# EAGLE schematic Shield (EAGLE 9.6.2)
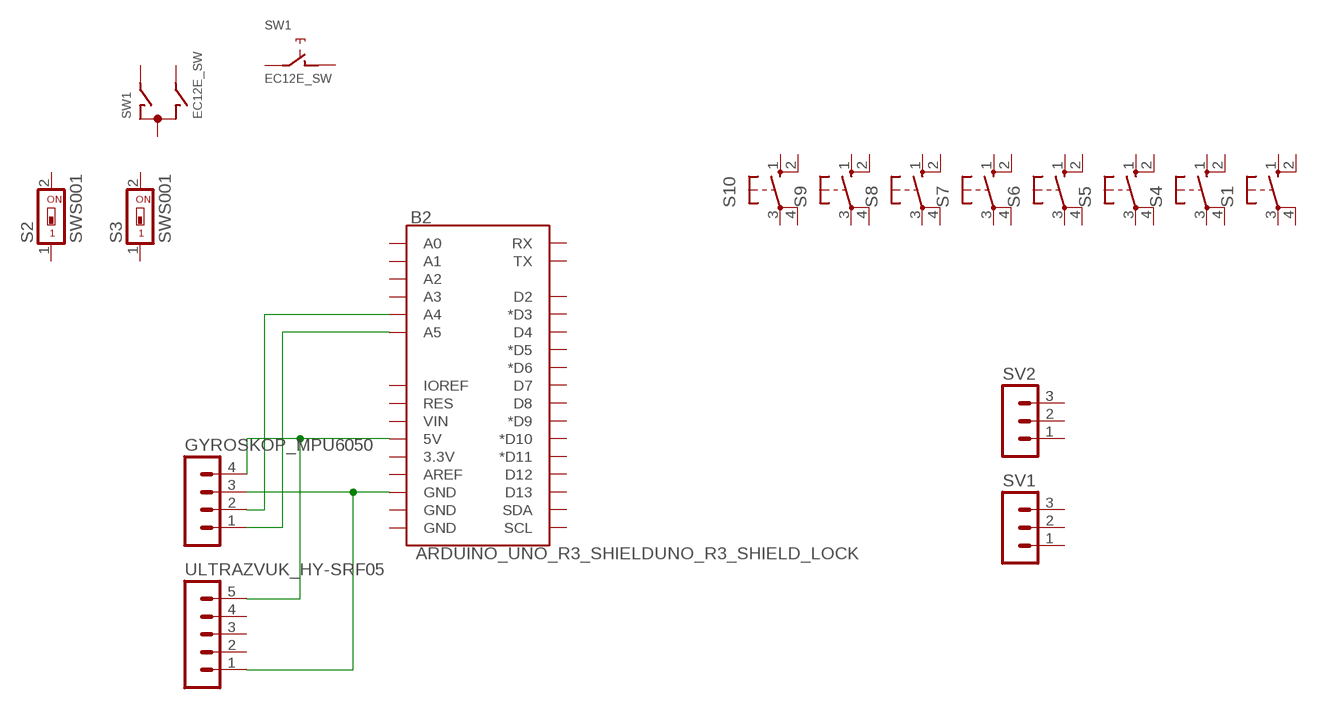
[diagram p0: schematic, sheet 1]

## Parts
B2  ARDUINO_UNO_R3_SHIELDUNO_R3_SHIELD_LOCK  [UNO_R3_SHIELD_LOCK]
GYROSKOP_MPU6050  MA04-1  [MA04-1]
S1  10-XX  [B3F-10XX]
S2  SWS001  [SMS-001]
S3  SWS001  [SMS-001]
S4  10-XX  [B3F-10XX]
S5  10-XX  [B3F-10XX]
S6  10-XX  [B3F-10XX]
S7  10-XX  [B3F-10XX]
S8  10-XX  [B3F-10XX]
S9  10-XX  [B3F-10XX]
S10  10-XX  [B3F-10XX]
SV1  MA03-1  [MA03-1]
SV2  MA03-1  [MA03-1]
SW1  EC12E_SW  [ALPS_EC12E_SW]
ULTRAZVUK_HY-SRF05  MA05-1  [MA05-1]

## Nets
N$1: B2.A4 GYROSKOP_MPU6050.2
N$2: B2.A5 GYROSKOP_MPU6050.1
N$3: B2.5V GYROSKOP_MPU6050.4 ULTRAZVUK_HY-SRF05.5
N$4: B2.GND@2(GND) GYROSKOP_MPU6050.3 ULTRAZVUK_HY-SRF05.1
Unconnected: B2.3.3V B2.A0 B2.A1 B2.A2 B2.A3 B2.AREF B2.D2 B2.D3(*D3) B2.D4 B2.D5(*D5) B2.D6(*D6) B2.D7 B2.D8 B2.D9(*D9) B2.D10(*D10) B2.D11(*D11) B2.D12 B2.D13 B2.GND@0(GND) B2.GND@1(GND) B2.IOREF B2.RES B2.RX B2.SCL B2.SDA B2.TX B2.VIN S1.1(S) S1.2(S1) S1.3(P) S1.4(P1) S2.1 S2.2 S3.1 S3.2 S4.1(S) S4.2(S1) S4.3(P) S4.4(P1) S5.1(S) S5.2(S1) S5.3(P) S5.4(P1) S6.1(S) S6.2(S1) S6.3(P) S6.4(P1) S7.1(S) S7.2(S1) S7.3(P) S7.4(P1) S8.1(S) S8.2(S1) S8.3(P) S8.4(P1) S9.1(S) S9.2(S1) S9.3(P) S9.4(P1) S10.1(S) S10.2(S1) S10.3(P) S10.4(P1) SV1.1 SV1.2 SV1.3 SV2.1 SV2.2 SV2.3 SW1.A SW1.B SW1.C SW1.D SW1.E SW1.GND1(G) SW1.GND2(G) ULTRAZVUK_HY-SRF05.2 ULTRAZVUK_HY-SRF05.3 ULTRAZVUK_HY-SRF05.4

## Library data of the parts
B2 = SparkFun-Boards:ARDUINO_UNO_R3_SHIELD: Arduino R3 Shield Footprint Shield form compatible with the Arduino Uno R3. SparkFun Products: MG2639 Cellular Shield <https://www.sparkfun.com/products/13120> MIDI Shield <https://www.sparkfun.com/products/12898> R3 Stackable Headers Kit <https://www.sparkfun.com/products/11417>
GYROSKOP_MPU6050 = con-lstb:MA04-1: PIN HEADER; OC_FARNELL: unknown; OC_NEWARK: unknown
S1 S4-S10 = switch-omron:10-XX: OMRON SWITCH; MPN: B3F-1000; OC_FARNELL: 176432; OC_NEWARK: 36M3542
S2 S3 = smd-special:SWS001: SMD Dip Switch 1 pol.
SV1 SV2 = con-lstb:MA03-1: PIN HEADER; OC_FARNELL: unknown; OC_NEWARK: unknown
SW1 = switch-alps:EC12E_SW: ALPS rotary Encoder EC12E series with switch; MPN: EC12E2424407; OC_FARNELL: 1520813; OC_NEWARK: 74M1068
ULTRAZVUK_HY-SRF05 = con-lstb:MA05-1: PIN HEADER; OC_FARNELL: unknown; OC_NEWARK: unknown